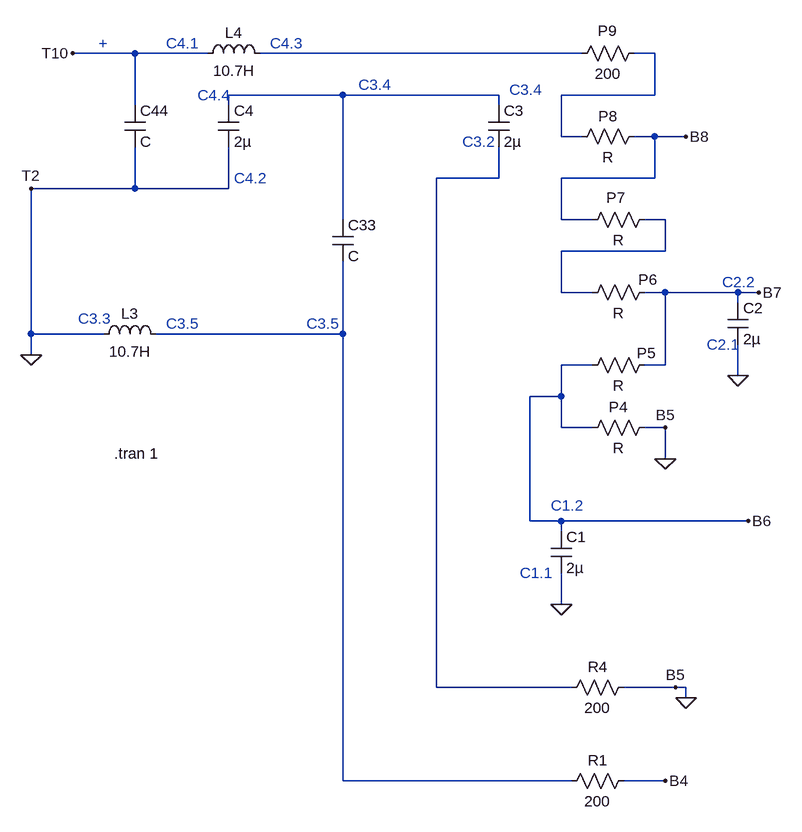
[diagram p0: schematic Ferrix-BL4.asc]
Ferrix-BL4.asc, the LTspice schematic file:
Version 4
SHEET 1 1712 1280
WIRE 304 -32 208 -32
WIRE 416 -32 304 -32
WIRE 992 -32 496 -32
WIRE 1104 -32 1072 -32
WIRE 624 32 448 32
WIRE 864 32 624 32
WIRE 1104 32 1104 -32
WIRE 1104 32 960 32
WIRE 304 48 304 -32
WIRE 448 48 448 32
WIRE 864 48 864 32
WIRE 960 96 960 32
WIRE 992 96 960 96
WIRE 1104 96 1072 96
WIRE 1152 96 1104 96
WIRE 864 160 864 112
WIRE 864 160 768 160
WIRE 1104 160 1104 96
WIRE 1104 160 960 160
WIRE 304 176 304 112
WIRE 304 176 144 176
WIRE 448 176 448 112
WIRE 448 176 304 176
WIRE 624 224 624 32
WIRE 960 224 960 160
WIRE 1008 224 960 224
WIRE 1120 224 1088 224
WIRE 1120 272 1120 224
WIRE 1120 272 960 272
WIRE 960 336 960 272
WIRE 1008 336 960 336
WIRE 1120 336 1088 336
WIRE 1232 336 1120 336
WIRE 1264 336 1232 336
WIRE 1232 352 1232 336
WIRE 144 400 144 176
WIRE 256 400 144 400
WIRE 624 400 624 288
WIRE 624 400 336 400
WIRE 144 432 144 400
WIRE 1008 448 960 448
WIRE 1120 448 1120 336
WIRE 1120 448 1088 448
WIRE 1232 464 1232 416
WIRE 960 496 960 448
WIRE 960 496 912 496
WIRE 960 544 960 496
WIRE 1008 544 960 544
WIRE 1120 544 1088 544
WIRE 1120 592 1120 544
WIRE 912 688 912 496
WIRE 960 688 912 688
WIRE 1248 688 960 688
WIRE 960 704 960 688
WIRE 960 816 960 768
WIRE 768 944 768 160
WIRE 976 944 768 944
WIRE 1136 944 1056 944
WIRE 1152 944 1136 944
WIRE 1152 960 1152 944
WIRE 624 1088 624 400
WIRE 976 1088 624 1088
WIRE 1120 1088 1056 1088
FLAG 208 -32 T10
FLAG 144 176 T2
FLAG 1152 96 B8
FLAG 1264 336 B7
FLAG 1248 688 B6
FLAG 1136 944 B5
FLAG 1120 1088 B4
FLAG 1152 960 0
FLAG 144 432 0
FLAG 1232 464 0
FLAG 960 816 0
FLAG 1120 592 0
FLAG 1120 544 B5
SYMBOL ind 400 -16 R270
WINDOW 0 32 56 VTop 2
WINDOW 3 5 56 VBottom 2
SYMATTR InstName L4
SYMATTR Value 10.7H
SYMATTR SpiceLine Rser=500
SYMBOL ind 240 416 R270
WINDOW 0 32 56 VTop 2
WINDOW 3 5 56 VBottom 2
SYMATTR InstName L3
SYMATTR Value 10.7H
SYMATTR SpiceLine Rser=500
SYMBOL res 1088 -48 R90
WINDOW 0 -3 57 VBottom 2
WINDOW 3 32 56 VTop 2
SYMATTR InstName P9
SYMATTR Value 200
SYMBOL res 1072 928 R90
WINDOW 0 0 56 VBottom 2
WINDOW 3 32 56 VTop 2
SYMATTR InstName R4
SYMATTR Value 200
SYMBOL cap 848 48 R0
SYMATTR InstName C3
SYMATTR Value 2µ
SYMBOL cap 432 48 R0
SYMATTR InstName C4
SYMATTR Value 2µ
SYMBOL cap 1216 352 R0
SYMATTR InstName C2
SYMATTR Value 2µ
SYMBOL cap 944 704 R0
SYMATTR InstName C1
SYMATTR Value 2µ
SYMBOL res 1072 1072 R90
WINDOW 0 0 56 VBottom 2
WINDOW 3 32 56 VTop 2
SYMATTR InstName R1
SYMATTR Value 200
SYMBOL cap 608 224 R0
SYMATTR InstName C33
SYMBOL cap 288 48 R0
SYMATTR InstName C44
SYMBOL res 1088 80 R90
WINDOW 0 0 56 VBottom 2
WINDOW 3 32 56 VTop 2
SYMATTR InstName P8
SYMBOL res 1104 432 R90
WINDOW 0 13 13 VBottom 2
WINDOW 3 32 56 VTop 2
SYMATTR InstName P5
SYMBOL res 1104 320 R90
WINDOW 0 12 11 VBottom 2
WINDOW 3 32 56 VTop 2
SYMATTR InstName P6
SYMBOL res 1104 208 R90
WINDOW 0 -2 60 VBottom 2
WINDOW 3 32 56 VTop 2
SYMATTR InstName P7
SYMBOL res 1104 528 R90
WINDOW 0 0 56 VBottom 2
WINDOW 3 32 56 VTop 2
SYMATTR InstName P4
TEXT 272 584 Left 2 !.tran 1
TEXT 512 -48 Left 2 ;C4.3
TEXT 352 -48 Left 2 ;C4.1
TEXT 456 160 Left 2 ;C4.2
TEXT 400 32 Left 2 ;C4.4
TEXT 880 24 Left 2 ;C3.4
TEXT 808 104 Left 2 ;C3.2
TEXT 896 768 Left 2 ;C1.1
TEXT 944 664 Left 2 ;C1.2
TEXT 1184 416 Left 2 ;C2.1
TEXT 1208 320 Left 2 ;C2.2
TEXT 216 376 Left 2 ;C3.3
TEXT 352 384 Left 2 ;C3.5
TEXT 248 -48 Left 2 ;+
TEXT 648 16 Left 2 ;C3.4
TEXT 568 384 Left 2 ;C3.5

The netlist it stands for:
* Ferrix-BL4.asc
L4 T10 N001 10.7H Rser=500
L3 0 N006 10.7H Rser=500
R§P9 N002 N001 200
R4 0 N004 200
C3 N003 N004 2µ
C4 N003 0 2µ
C2 B7 0 2µ
C1 B6 0 2µ
R1 B4 N006 200
C33 N003 N006 C
C44 T10 0 C
R§P8 B8 N002 R
R§P5 B7 B6 R
R§P6 B7 N005 R
R§P7 N005 B8 R
R§P4 0 B6 R
.tran 1
* C4.3
* C4.1
* C4.2
* C4.4
* C3.4
* C3.2
* C1.1
* C1.2
* C2.1
* C2.2
* C3.3
* C3.5
* +
* C3.4
* C3.5
.backanno
.end